# Altium schematic sheet [07] - Motor.SchDoc: =ProjectName
size A4; CheckedBy: Ven; Author: Ven; CompanyName: HUST; Revision: V.1.0
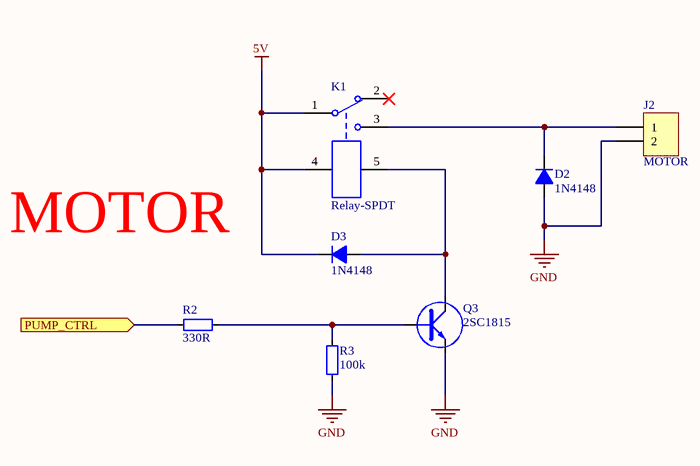
[diagram p0: [07] - Motor.SchDoc]

## Parts
D2  1N4148  [1N4148_SMD]
D3  1N4148  [1N4148_SMD]
J2  MOTOR  [KF2-5.08]
K1  Relay-SPDT  [RELAY5PIN-10A]
Q3  2SC1815  [SOT23]
R2  330R  [RES-SMD-0805]
R3  100k  [RES-SMD-0805]

## Ports
PUMP_CTRL (in)

## Nets
5V: D3.2(K) K1.1 K1.4
GND: D2.1(A) J2.2 Q3.3(E) R3.1
PUMP_CTRL: R2.1 ; port PUMP_CTRL
NetD2_2: D2.2(K) J2.1 K1.3
NetD3_1: D3.1(A) K1.5 Q3.2(C)
NetQ3_1: Q3.1(B) R2.2 R3.2

Not connected (* = marked no-connect by the designer): K1 2*

## Notes on the sheet
- MOTOR
- Project:
- Page Contents:
- Size:
- Date:
- A4
- Checked by:
- Time:
- Revision:
- Sheet
- of
- File:

## Library data of the parts
D2 D3 = D1A: Diode 1A; Value: 1N4007
J2 = KF2: Manufacturer: Würth Elektronik eiSos GmbH; partNo: 691103110002; ComponentLink1 Description: Manufacturer; ComponentLink2 Description: Datasheet; NoPins: 2; Created Date: 29 October 2013; ComponentLink1URL: http://www.we-online.com; ComponentLink2URL: http://katalog.we-online.de/em/datasheet/6911031100xx.pdf; Created by: Karrer Zheng
K1 = Relay-SPDT: Single-Pole Dual-Throw Relay; Published: 24-Mar-1999; LatestRevisionDate: 17-Jul-2002; LatestRevisionNote: Re-released for DXP Platform.; PackageReference: MODULE5B; Publisher: Altium Limited
Q3 = 2SC1815: NPN 600mW, ECB; Value: C1815
R2 R3 = Resistor - SMD: Resistor; Manufacturer: Generic Components; Class: Passive; Published: 08/06/2000; Publisher: Altium Hobart Technology Centre